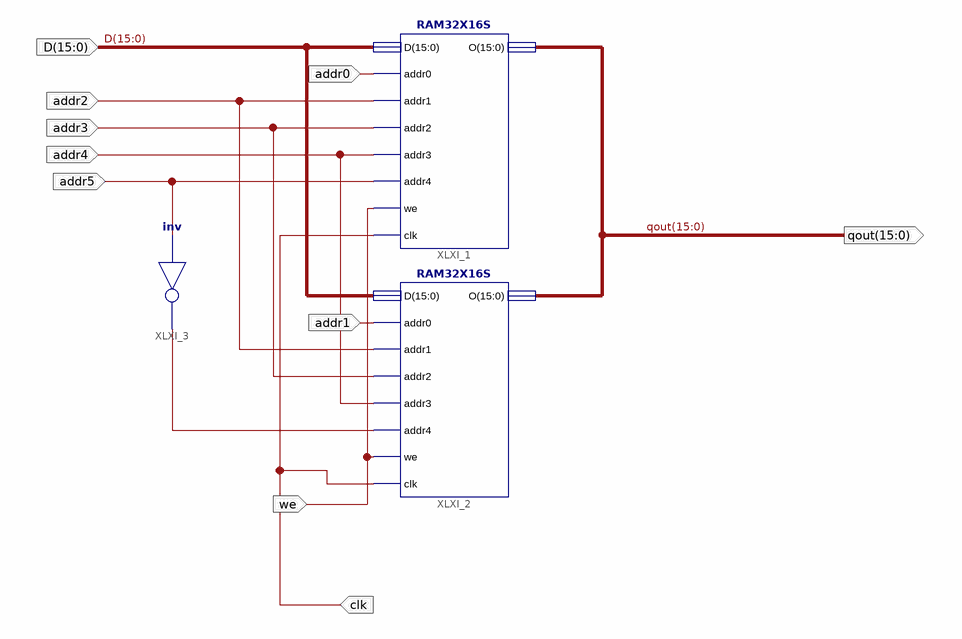
[diagram p0: schematic sheet 1]
// Xilinx ISE schematic RAM64X16s.sch (spartan3e) as structural Verilog: 3 symbols, 10 ports
module RAM64X16s (
  input  [15:0] D,
  input  addr5,
  input  addr4,
  input  addr3,
  input  addr2,
  input  addr1,
  input  addr0,
  input  we,
  input  clk,
  output [15:0] qout
);

  wire XLXN_6;

  RAM32X16S XLXI_1 (
    .addr0(addr0), .addr1(addr2), .addr2(addr3), .addr3(addr4), .addr4(addr5), .clk(clk), .D(D), .O(qout),
    .we(we));
  RAM32X16S XLXI_2 (
    .addr0(addr1), .addr1(addr2), .addr2(addr3), .addr3(addr4), .addr4(XLXN_6), .clk(clk), .D(D), .O(qout),
    .we(we));
  not XLXI_3 (XLXN_6, addr5);
endmodule
